# Altium project Smartfin Main PCBA.PrjPcb (part 1 of 2)
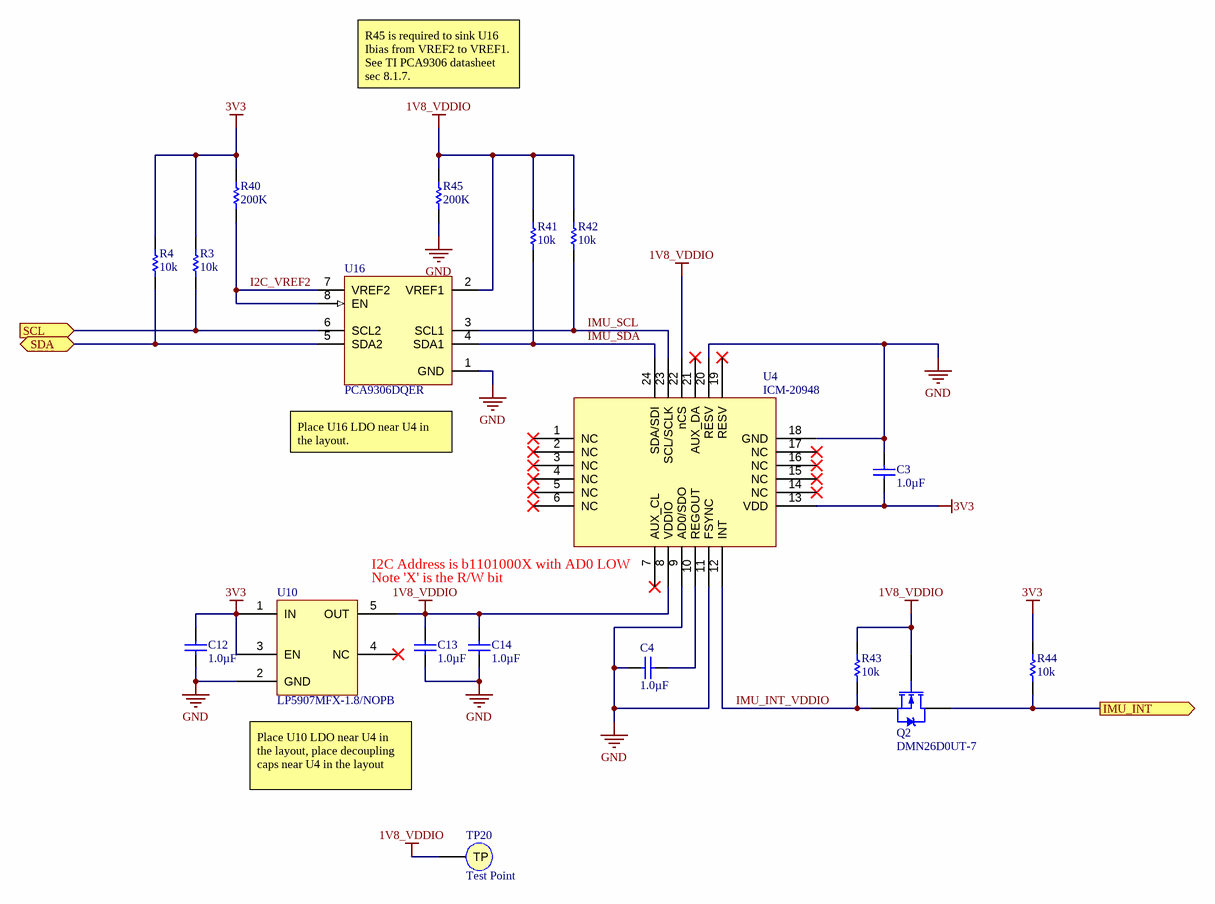
[diagram p0: Smartfin Main PCBA Motion.SchDoc]
ASY_Accept_RB_Value: 1; ASY_BOM_FILE_NAME: 644-001-031 BOM REV C ECO13237.XLSX; ASY_CLASS: 2; ASY_Confirmal_Coat_CB_Value: 0; ASY_CURRENT_REV: C; ASY_ECO_DATE1: 10/24/2019; ASY_ECO_DATE2: 2/10/2020; ASY_ECO_DATE3: 8/17/2020; ASY_ECO_DESC1: INITIAL RELEASE; ASY_ECO_DESC2: MISCELLANEOUS UPDATES. SEE ECO FOR DETAILS.; ASY_ECO_DESC3: UPDATED ASSY NOTES. UPDATED SS IN PCB. UPDATED BOM. SEE ECO FOR DETAILS.; ASY_ECO_NUM1: 12932; ASY_ECO_NUM2: 13065; ASY_ECO_NUM3: 13237; ASY_ECO_NUM_CURRENT: 13237; ASY_ECO_REV1: A; ASY_ECO_REV2: B; ASY_ECO_REV3: C; ASY_Moisture_Sensitive_CB_Value: 1; ASY_NAME: Smartfin Main PCBA; ASY_ROHS: ROHS COMPLIANT LEAD-FREE SOLDER PROCESS REQUIRED; ASY_RoHS_CB_Value: True; ASY_WASH: NOT PERMITTED; ASY_Wash_CB_Value: 0; ASY_XYRS_FILE_NAME: 644-001-032 ASY REV C XYRS ECO13237.TXT; ASYDWG_DOCNUM: 644-001-032; ASYDWG_MOISTURE_SENSITIVE: THIS DESIGN DOES NOT INCLUDE MOISTURE SENSITIVE PARTS; ASYNOTE_1: 1.  DIMENSIONS ARE IN INCHES.; ASYNOTE_2: 2.  REFER TO "644-001-031 BOM REV C ECO13237.XLSX" IN THIS ARCHIVE; ASYNOTE_4: 4.  REFER TO "644-001-032 ASY REV C XYRS ECO13237.TXT" IN THIS ARCHIVE; ASYNOTE_5: 5.  LEAD-FREE SOLDER PROCESS REQUIRED (ROHS).; ASYNOTE_7: 7.  AQUEOUS WASH IS NOT PERMITTED.; ASYNOTE_8: 8.  THIS DESIGN DOES INCLUDE MOISTURE SENSITIVE PARTS.; ASYNOTE_9: 9.  DO NOT APPLY CONFORMAL COATING.; ASYNOTE_10: 10. FINAL ASSEMBLY SHALL CONFORM TO IPC-A-610 CLASS 2.; ASYNOTE_11: 11. LABEL EACH ASSEMBLY WITH STANDARD IN HOUSE BUILD ID AND BOARD NUMBER.; ASYNOTE_MOISTURESENSITIVE: FALSE; ASYNOTE_ROHS: TRUE; ASYNOTE_WASH: FALSE; BASELINE_CURRENT_REV: C; BASELINE_DOCNUM: 644-001-033; BASELINE_ECO_DATE1: 10/24/2019; BASELINE_ECO_DATE2: 2/10/2020; BASELINE_ECO_DATE3: 8/17/2020; BASELINE_ECO_NUM1: 12932; BASELINE_ECO_NUM2: 13065; BASELINE_ECO_NUM3: 13237; BASELINE_ECO_NUM_CURRENT: 13237; BASELINE_ECO_REV1: A; BASELINE_ECO_REV2: B; BASELINE_ECO_REV3: C; BOM_DOCNUM: 644-001-031; CONTACT_EMAIL: ADOMINO@SYNCRONESS.COM; CONTACT_NAME: AMY DOMINO; CONTACT_PHONE: 720-409-5253; FAB_ACCEPT_RG_VALUE: 1; FAB_CURRENT_REV: C; FAB_DIMENSIONS: INCHES; FAB_DIMENSIONS_RG_VALUE: 0; FAB_DRILL_TOLERANCE: 0.003"; FAB_ECO_DATE1: 10/24/2019; FAB_ECO_DATE2: 2/10/2020; FAB_ECO_DATE3: 8/17/2020; FAB_ECO_DESC1: INITIAL RELEASE; FAB_ECO_DESC2: MISCELLANEOUS UPDATES. SEE ECO FOR DETAILS.; FAB_ECO_DESC3: UPDATED SS IN GPS AREA. MODIFED INTERNAL GND POURS IN GPS AREA. SEE ECO FOR DETAILS.; FAB_ECO_NUM1: 12932; FAB_ECO_NUM2: 13065; FAB_ECO_NUM3: 13237; FAB_ECO_NUM_CURRENT: 13237; FAB_ECO_REV1: A; FAB_ECO_REV2: B; FAB_ECO_REV3: C; FAB_FAB_CLASS: 2; FAB_FINISH_RG_VALUE: 0; FAB_FINISHED_CU_WEIGHT: 1.5; FAB_HOLE_LOCATION: 0.008"; FAB_INSPECT_CLASS: 2; FAB_IPC_STD: IPC-6012; FAB_LAYER_REGISTRATION: 0.005"; FAB_LAYERS: 4; FAB_MATERIAL: FR370-HR; FAB_MATERIAL_RG_VALUE: 3; FAB_MIN_ANNULAR_RING: 0.005"; FAB_OVERLAY_COLOR: WHITE; FAB_ROHS: SHALL BE ROHS COMPLIANT; FAB_SOLDER_SLIVERS: 0.004"; FAB_SOLDERMASK_COLOR: BLUE; FAB_STACKUP: USE FABRICATOR'S STANDARD LAYER STACK; FAB_STACKUP_CB_VALUE: 0; FAB_STANDARD_RG_VALUE: 1; FAB_SURFACE_FINISH: ENIG; FAB_THICKNESS: 0.032; FAB_THIEVING_SPACE: 0.100"; FABDWG_DOCNUM: 644-001-024; FABNOTE_1: 1.  DIMENSIONS ARE IN INCHES.; FABNOTE_2A: 2.  FABRICATE PCB PER IPC-6011 AND IPC-6012A, CLASS 2.; FABNOTE_2B: INSPECT PER IPC-A-600, CLASS 2.; FABNOTE_5: 5.  PCB MATERIAL IS EPOXY FIBERGLASS FR370-HR.; FABNOTE_6: 6.  PCB IS 4 LAYERS, THICKNESS IS 0.032", USE FABRICATOR'S STANDARD LAYER STACK.; FABNOTE_9: 9.  SOLDER MASK BOTH SIDES PER IPC-SM-840, COLOR IS BLUE.; FABNOTE_10: 10. OVERLAY ON BOTH SIDES, COLOR IS WHITE, UL-94V0 MARK REQUIRED.; FABNOTE_11: 11. SURFACE FINISH ON ALL EXPOSED COPPER SHALL BE ENIG.; FABNOTE_12: 12. FINISHED PCB SHALL BE ROHS COMPLIANT.; FABNOTE_CUSTOMSTACK: FALSE; FABNOTE_LAYERS: 4; FABNOTE_THICKNESS: 0.032; OVERLAY_COLOR: WHITE; OVERLAY_USE_LPI: FALSE; PROJECT_NAME: Smartfin; PROJECT_NUM: 644-001; SCH_CURRENT_REV: C; SCH_DOCNUM: 644-001-023; SOLDERMASK_COLOR: BLUE; SOLDERMASK_USE_LPI: FALSE
5 sheets, 126 parts. Net scope: flat (ports and power ports of the same name join across sheets).
Board file: Smartfin Main PCBA.PcbDoc
Sheets:
  Smartfin Main PCBA Motion.SchDoc
  Smartfin Main PCBA GPS.SchDoc
  Smartfin Main PCBA Control.SchDoc
  Smartfin Main PCBA USB.SchDoc
  Smartfin Main PCBA Wet Dry Sensor.SchDoc

## Sheet Smartfin Main PCBA Motion.SchDoc: Motion
size Tabloid; TOCFontName: Consolas; TOCFontSize: 24; TOCFontColor: 0; TOCFontAttributes: 0; TOCMaxLinesInTable: 25; TOCVerticalOffset: 200; TOCHorizontalOffset: 500; TOCHorizontalSeparation: 800; TOCVerticalSeparation: 30; TOCHorizTableSize: 640; Engineer: Amy Domino; DocumentNumber: 644-001-023; Revision: A; SheetNumber: 4; SheetTotal: 9; PageSetup: Record=PageOptions|CenterHorizontal=True|CenterVertical=True|PrintScale=0.96|XCorrection=1.00|YCorrection=1.00|PrintKind=0|BorderSize=5000000|LeftOffset=0|BottomOffset=0|Orientation=2|PaperLength=1000|PaperWidth=1000|Scale=100|PaperSource=7|PrintQuality=-4|MediaType=1|DitherType=10|PaperKind=11" x 17"|PrintScaleMode=1

### Parts
C3  1.0µF  [CAPC0402(1005)60_N]
C4  1.0µF  [CAPC0402(1005)60_N]
C12  1.0µF  [CAPC0402(1005)60_N]
C13  1.0µF  [CAPC0402(1005)60_N]
C14  1.0µF  [CAPC0402(1005)60_N]
Q2  DMN26D0UT-7  [DMN26D0UT-7-Footprint-1]
R3  10k  [RESC0402(1005)_N]
R4  10k  [RESC0402(1005)_N]
R40  200K  [RESC0402(1005)_N]
R41  10k  [RESC0402(1005)_N]
R42  10k  [RESC0402(1005)_N]
R43  10k  [RESC0402(1005)_N]
R44  10k  [RESC0402(1005)_N]
R45  200K  [RESC0402(1005)_N]
TP20  Test Point  [TESTPAD_ICT]  (no BOM)
U4  ICM-20948  [ICM-20948-Footprint-1]
U10  LP5907MFX-1.8/NOPB  [SOT95P280X145-5N]
U16  PCA9306DQER  [QFN35P100X140X40-8L]

### Ports
IMU_INT (out), SCL (in), SDA (bidir)

### Nets
1V8_VDDIO: C13.2 C14.2 Q2.G R41.2 R42.2 R43.2 R45.2 TP20.1(TP) U4.8(VDDIO) U4.22(nCS) U10.5(OUT) U16.2(VREF1)
3V3: C3.1 C12.2 R3.2 R4.2 R40.2 R44.2 U4.13(VDD) U10.1(IN) U10.3(EN)
GND: C3.2 C4.1 C12.1 C13.1 C14.1 R45.1 U4.9(AD0/SDO) U4.11(FSYNC) U4.18(GND) U4.20(RESV) U10.2(GND) U16.1(GND)
I2C_VREF2: R40.1 U16.7(VREF2) U16.8(EN)
IMU_INT: Q2.D R44.1 ; port IMU_INT
IMU_INT_VDDIO: Q2.S R43.1 U4.12(INT)
IMU_SCL: R42.1 U4.23(SCL/SCLK) U16.3(SCL1)
IMU_SDA: R41.1 U4.24(SDA/SDI) U16.4(SDA1)
SCL: R3.1 U16.6(SCL2) ; port SCL
SDA: R4.1 U16.5(SDA2) ; port SDA
NetC4_2: C4.2 U4.10(REGOUT)

Not connected (* = marked no-connect by the designer): U4 1(NC)* 2(NC)* 3(NC)* 4(NC)* 5(NC)* 6(NC)* 7(AUX_CL)* 14(NC)* 15(NC)* 16(NC)* 17(NC)* 19(RESV)* 21(AUX_DA)*; U10 4(NC)*

### Notes on the sheet
- R45 is required to sink U16 Ibias from VREF2 to VREF1. See TI PCA9306 datasheet sec 8.1.7.
- (near U16) Place U16 LDO near U4 in the layout.
- (near U4) I2C Address is b1101000X with AD0 LOW
- Note 'X' is the R/W bit
- (near U10) Place U10 LDO near U4 in the layout, place decoupling caps near U4 in the layout
- TITLE
- DOC NUMBER
- VARIANT
- REV
- 10875 dover st, suite 500
  westminster, co, 80021, usa
  syncroness.com
- FILE
- ENGINEER
- SHEET
- DATE
- OF
- THIS DOCUMENT IS CONFIDENTIAL AND THE PROPERTY OF SYNCRONESS, INC. AND ITS SUBSIDARIES. IT SHALL NOT BE REPRODUCED IN ANY MANNER NOR USED FOR ANY PURPOSE WHATSOEVER EXCEPT AS SPECIFIED IN WRITING BY SYNCRONESS, INC.

### Library data of the parts
C3 C4 C12-C14 = CMP-13694-A.6: CAP CER 1UF 10V 10% X5R 0402; Manufacturer: Yageo; Manufacturer Part Number: CC0402KRX5R6BB105; Manufacturer 2: Samsung Electro-Mechanics; Manufacturer 3: AVX Corporation; Manufacturer Part Number 2: CL05A105KP5NNNC; Manufacturer Part Number 3: 0402ZD105KAT2A; Operating Temperature: -55°C ~ 85°C; Supplier Part Number 1: 311-1439-1-ND; Supplier Part Number 2: 1276-1076-1-ND; Supplier Part Number 3: 478-4596-1-ND; Temperature Coefficient: X5R; Tolerance: ±10%; Capacitance: 1.0µF; Voltage - Rated: 10V; Supplier 2: Digi-Key; Supplier 3: Digi-Key; Supplier 1: Digi-Key; Datasheet: http://www.samsungsem.com/kr/support/product-search/mlcc/__icsFiles/afieldfile/2019/05/10/19-CL05A105KP5NNNC.pdf
Q2 = CMP-23815-A.1: MOSFET N-CH 20V 230MA SOT523; Manufacturer: Diodes Incorporated; Input Capacitance: 14.1pF; Max Power Dissipation: 300mW; Number of Elements: 1; Rds On Max: 3R; Rise Time: 7.9ns; Fall Time: 15.2ns; Turn-Off Delay Time: 13.4ns; Turn-On Delay Time: 3.8ns; Threshold Voltage: 1V; Element Configuration: Single; Gate to Source Voltage (Vgs): 10V; Mount: Surface Mount; Case/Package: SOT-523; Number of Pins: 3; Weight: 7.1E-05oz; Min Operating Temperature: -55°C; Max Operating Temperature: 150°C; Package Quantity: 1; Drain to Source Voltage (Vdss): 20V; Continuous Drain Current (ID): 230mA; Drain to Source Breakdown Voltage: 20V; Drain to Source Resistance: 3R; Power Dissipation: 300mW; Number of Channels: 1; On-State Resistance: 3R; Length: 1.7mm; Height: 0.8mm; Width: 0.85mm; Radiation Hardening: No; REACH SVHC: No SVHC; Lead Free: Lead Free; Manufacturer Part Number: DMN26D0UT-7; Supplier: Digi-Key; Supplier Part Number: DMN26D0UT-7DICT-ND
R3 R4 R41-R44 = CMP-15831-A.1: RES SMD 10K OHM 0.1% 1/16W 0402; Manufacturer: Panasonic Electronic Components; Manufacturer Part Number: ERA-2ARB103X; Power (Watts): 0.063W, 1/16W; Temperature Coefficient: ±10ppm/°C; Packaging: Cut Tape (CT); Part Status: Active; Resistance (Ohms): 10k; Tolerance: ±0.1%; Composition: Thin Film; Features: Automotive AEC-Q200; Operating Temperature: -55°C ~ 155°C; Package / Case: 0402 (1005 Metric); Supplier Device Package: 0402; Size / Dimension: 0.039" L x 0.020" W (1.00mm x 0.50mm); Height - Seated (Max): 0.016" (0.40mm); Failure Rate: -; Supplier: Digi-Key; Supplier Part Number: P10KCPCT-ND; ComponentLink1Description: Datasheet; ComponentLink1URL: https://industrial.panasonic.com/cdbs/www-data/pdf/RDM0000/AOA0000C237.pdf
R40 R45 = CMP-10579-A.1: RES 200K OHM 1/16W 5% 0402 SMD; Manufacturer: Yageo; Manufacturer Part Number: RC0402JR-07200KL; Temperature Coefficient: ±100ppm/°C; Resistance: 200K; Supplier Part Number 1: 311-200KJRCT-ND; Tolerance: 5%; Wattage: 1/16 W; Composition: Thick Film; Supplier 1: Digikey; Supplier 4: Digikey; Supplier 2: Digikey; Supplier 3: Digikey; Supplier 5: Digikey
TP20 = CMP-08242-A.3: ICT Test Point
U4 = CMP-23688-A.7: IMU ACCEL/GYRO/COMPI2C/SPI 24QFN; Manufacturer: TDK InvenSense; Sensor Type: Accelerometer,Gyroscope,Magnetometer; Output Type: SPI,I2C; Mount: Surface Mount; Case/Package: QFN; Min Operating Temperature: -40°C; Max Operating Temperature: 85°C; Packaging: Tape and Reel; Manufacturer Part Number: ICM-20948; Supplier: Digi-Key; Supplier Part Number: 1428-1123-1-ND
U10 = CMP-23434-A.4: IC REG LDO 1.8V 0.25A SOT23-5; Manufacturer: Texas Instruments; Min Input Voltage: 2.2V; Dropout Voltage: 250mV; Max Input Voltage: 5.5V; Output Current: 250mA; Polarity: Positive; Quiescent Current: 25uA; Power Supply Rejection Ratio (PSRR): 82dB; Accuracy: 2%; Case/Package: SOT-23; Contact Plating: Tin; Min Operating Temperature: -40°C ~ 125°C; Output Voltage: 1.8V; Nominal Output Voltage: 1.8V; Max Output Current: 250mA; REACH SVHC: No SVHC; Datasheet: http://www.ti.com/lit/ds/symlink/lp5907.pdf; Manufacturer Part Number: LP5907MFX-1.8/NOPB; Supplier: Digi-Key; Supplier Part Number: 296-41463-1-ND
U16 = CMP-06761-4: IC V-LEVL XLATR I2C/SMBUS 8X2SON; Manufacturer: Texas Instruments; Logic Function: Translator, Bidirectional, Open Drain; Number of Bits: 2; Output Type: I²C™/SMBus™; Number of Outputs/Channel: 1; Differential - Input:Output: No/No; Propagation Delay (Max): 0.3ns; Voltage - Supply: 1.2 V ~ 3.3 V, 1.8 V ~ 5.5 V; Supplier 1: Digi-Key; Supplier Part Number 1: 296-27957-1-ND; RoHS: RoHS Compliant; Category: Integrated Circuits (ICs); Stock: 18548; Pricing: 1=0.94, 10=0.829, 25=0.7488, 100=0.6552, 250=0.5746, 500=0.5096, 1000=0.403, 2500=0.3744 (USD); Packaging: Cut Tape (CT); Input Type: I2C/SMBus; Data Rate: -; Number of Channels: 2; Operating Temperature: -40°C ~ 85°C; Package / Case: 8-XFDFN; Supplier Device Package: 8-X2SON (1.4x1.0); Mounting Type: Surface Mount; ComponentLink1URL: http://www.ti.com/lit/ds/symlink/pca9306.pdf; ComponentLink1Description: Datasheet; Manufacturer Part Number: PCA9306DQER

## Sheet Smartfin Main PCBA GPS.SchDoc: GPS
size Tabloid; TOCFontName: Consolas; TOCFontSize: 24; TOCFontColor: 0; TOCFontAttributes: 0; TOCMaxLinesInTable: 25; TOCVerticalOffset: 200; TOCHorizontalOffset: 500; TOCHorizontalSeparation: 800; TOCVerticalSeparation: 30; TOCHorizTableSize: 640; Engineer: Amy Domino; DocumentNumber: 644-001-023; Revision: A; SheetNumber: 5; SheetTotal: 9; PageSetup: Record=PageOptions|CenterHorizontal=True|CenterVertical=True|PrintScale=0.96|XCorrection=1.00|YCorrection=1.00|PrintKind=0|BorderSize=5000000|LeftOffset=0|BottomOffset=0|Orientation=2|PaperLength=1000|PaperWidth=1000|Scale=100|PaperSource=7|PrintQuality=-4|MediaType=1|DitherType=10|PaperKind=11" x 17"|PrintScaleMode=1
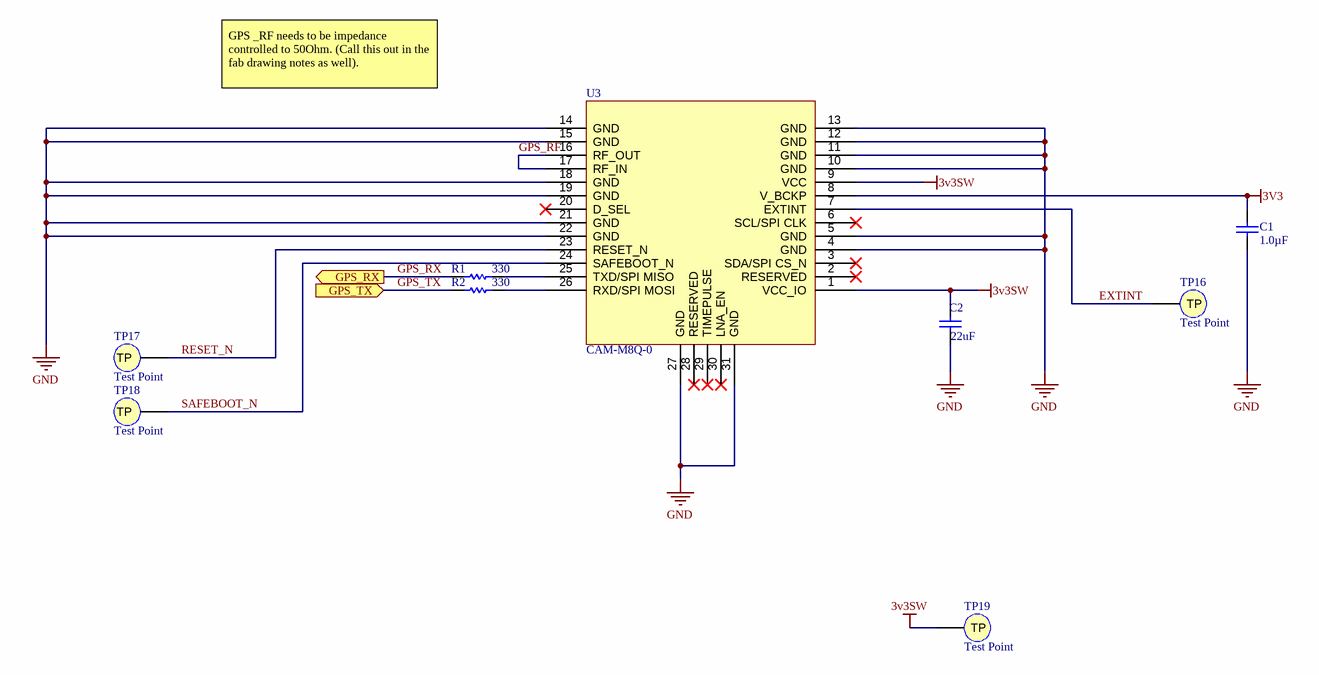
[diagram p1: Smartfin Main PCBA GPS.SchDoc]

### Parts
C1  1.0µF  [CAPC0402(1005)60_N]
C2  22uF  [CAPC0603(1608)100_N]
R1  330  [RESC1005X04N]
R2  330  [RESC1005X04N]
TP16  Test Point  [TESTPAD_ICT]  (no BOM)
TP17  Test Point  [TESTPAD_ICT]  (no BOM)
TP18  Test Point  [TESTPAD_ICT]  (no BOM)
TP19  Test Point  [TESTPAD_ICT]  (no BOM)
U3  CAM-M8Q-0  [CAM-M8Q-0-Footprint-1]

### Ports
GPS_RX (out), GPS_TX (in)

### Nets
3V3: C1.2 U3.8(V_BCKP)
3v3SW: C2.2 TP19.1(TP) U3.1(VCC_IO) U3.9(VCC)
GND: C1.1 C2.1 U3.4(GND) U3.5(GND) U3.10(GND) U3.11(GND) U3.12(GND) U3.13(GND) U3.14(GND) U3.15(GND) U3.18(GND) U3.19(GND) U3.21(GND) U3.22(GND) U3.27(GND) U3.31(GND)
EXTINT: TP16.1(TP) U3.7(EXTINT)
GPS_RF: U3.16(RF_OUT) U3.17(RF_IN)
GPS_RX: R1.1 ; port GPS_RX
GPS_TX: R2.1 ; port GPS_TX
RESET_N: TP17.1(TP) U3.23(RESET_N)
SAFEBOOT_N: TP18.1(TP) U3.24(SAFEBOOT_N)
NetR1_2: R1.2 U3.25(TXD/SPI_MISO)
NetR2_2: R2.2 U3.26(RXD/SPI_MOSI)

Not connected (* = marked no-connect by the designer): U3 2(RESERVED)* 3(SDA/SPI_CS_N)* 6(SCL/SPI_CLK)* 20(D_SEL)* 28(RESERVED)* 29(TIMEPULSE)* 30(LNA_EN)*

### Notes on the sheet
- GPS _RF needs to be impedance controlled to 50Ohm. (Call this out in the fab drawing notes as well).
- TITLE
- DOC NUMBER
- VARIANT
- REV
- 10875 dover st, suite 500
  westminster, co, 80021, usa
  syncroness.com
- FILE
- ENGINEER
- SHEET
- DATE
- OF
- THIS DOCUMENT IS CONFIDENTIAL AND THE PROPERTY OF SYNCRONESS, INC. AND ITS SUBSIDARIES. IT SHALL NOT BE REPRODUCED IN ANY MANNER NOR USED FOR ANY PURPOSE WHATSOEVER EXCEPT AS SPECIFIED IN WRITING BY SYNCRONESS, INC.

### Library data of the parts
C1 = CMP-13694-A.6: as C3 on sheet Smartfin Main PCBA Motion; Manufacturer 2: Samsung Electro-Mechanics; Manufacturer 3: AVX Corporation; Manufacturer Part Number 2: CL05A105KP5NNNC; Manufacturer Part Number 3: 0402ZD105KAT2A; Operating Temperature: -55°C ~ 85°C; Supplier Part Number 1: 311-1439-1-ND; Supplier Part Number 2: 1276-1076-1-ND; Supplier Part Number 3: 478-4596-1-ND; Temperature Coefficient: X5R; Tolerance: ±10%; Capacitance: 1.0µF; Voltage - Rated: 10V; Supplier 2: Digi-Key; Supplier 3: Digi-Key; Supplier 1: Digi-Key; Datasheet: http://www.samsungsem.com/kr/support/product-search/mlcc/__icsFiles/afieldfile/2019/05/10/19-CL05A105KP5NNNC.pdf
C2 = CMP-23693-A.2: CAP CER 22UF 10V X5R 0603; Manufacturer: Murata Electronics; Manufacturer Part Number: GRM188R61A226ME15D; Tolerance: 20%; Case/Package: 0603; Case Code (Metric): 1608; Case Code (Imperial): 0603; Capacitance: 22uF; Voltage Rating: 10V; Dielectric: X5R; Height: 1mm; Width: 0.8mm; Manufacturer 2: Samsung Electro-Mechanics; Manufacturer 3: TDK Corporation; Manufacturer Part Number 2: CL10A226MPCNUBE; Manufacturer Part Number 3: C1608X5R1A226M080AC; Operating Temperature: -55°C ~ 85°C; Supplier 1: Digi-Key; Supplier 2: Digi-Key; Supplier 3: Digi-Key; Supplier Part Number 1: 490-10476-1-ND; Supplier Part Number 2: 1276-6504-1-ND; Supplier Part Number 3: 445-9077-1-ND
R1 R2 = CMP-22585-A.1: RES SMD 330 OHM 1% 1/16W 0402; Manufacturer: Vishay Dale; Manufacturer Part Number: CRCW0402330RFKED; Power (Watts): 0.063W, 1/16W; Temperature Coefficient: ±100ppm/°C; Resistance: 330 Ohms; ComponentLink1Description: Datasheet; ComponentLink1URL: http://www.vishay.com/docs/20035/dcrcwe3.pdf; Composition: Thick Film; Features: AEC-Q200; Height - Seated (Max): 0.016" (0.40mm); Operating Temperature: -55°C ~ 155°C; Package / Case: 0402 (1005 Metric); Size / Dimension: 0.039" L x 0.020" W (1.00mm x 0.50mm); Supplier: Digi-Key; Supplier Part Number: 541-330LCT-ND; Tolerance: ±1%
TP16-TP19 = CMP-08242-A.3: ICT Test Point
U3 = CMP-23691-A.8: RF RCVR GNSS/GPS 1.575GHZ MODULE; Manufacturer: U-Blox; Interface: SPI,UART; Sensitivity: -167dBm; Current - Receiving: 29mA; Case/Package: SMD/SMT; Min Operating Temperature: -40°C; Max Operating Temperature: 85°C; Packaging: Tape and Reel; Frequency: 1.575GHz; Manufacturer Part Number: CAM-M8Q-0; Supplier: Digi-Key; Supplier Part Number: 672-CAM-M8Q-0-10CT-ND

## Sheet Smartfin Main PCBA Control.SchDoc: Control
size Tabloid; TOCFontName: Consolas; TOCFontSize: 24; TOCFontColor: 0; TOCFontAttributes: 0; TOCMaxLinesInTable: 25; TOCVerticalOffset: 200; TOCHorizontalOffset: 500; TOCHorizontalSeparation: 800; TOCVerticalSeparation: 30; TOCHorizTableSize: 640; Engineer: Amy Domino; DocumentNumber: 644-001-023; Revision: A; SheetNumber: 6; SheetTotal: 9; PageSetup: Record=PageOptions|CenterHorizontal=True|CenterVertical=True|PrintScale=0.96|XCorrection=1.00|YCorrection=1.00|PrintKind=0|BorderSize=5000000|LeftOffset=0|BottomOffset=0|Orientation=2|PaperLength=1000|PaperWidth=1000|Scale=100|PaperSource=7|PrintQuality=-4|MediaType=1|DitherType=10|PaperKind=11" x 17"|PrintScaleMode=1
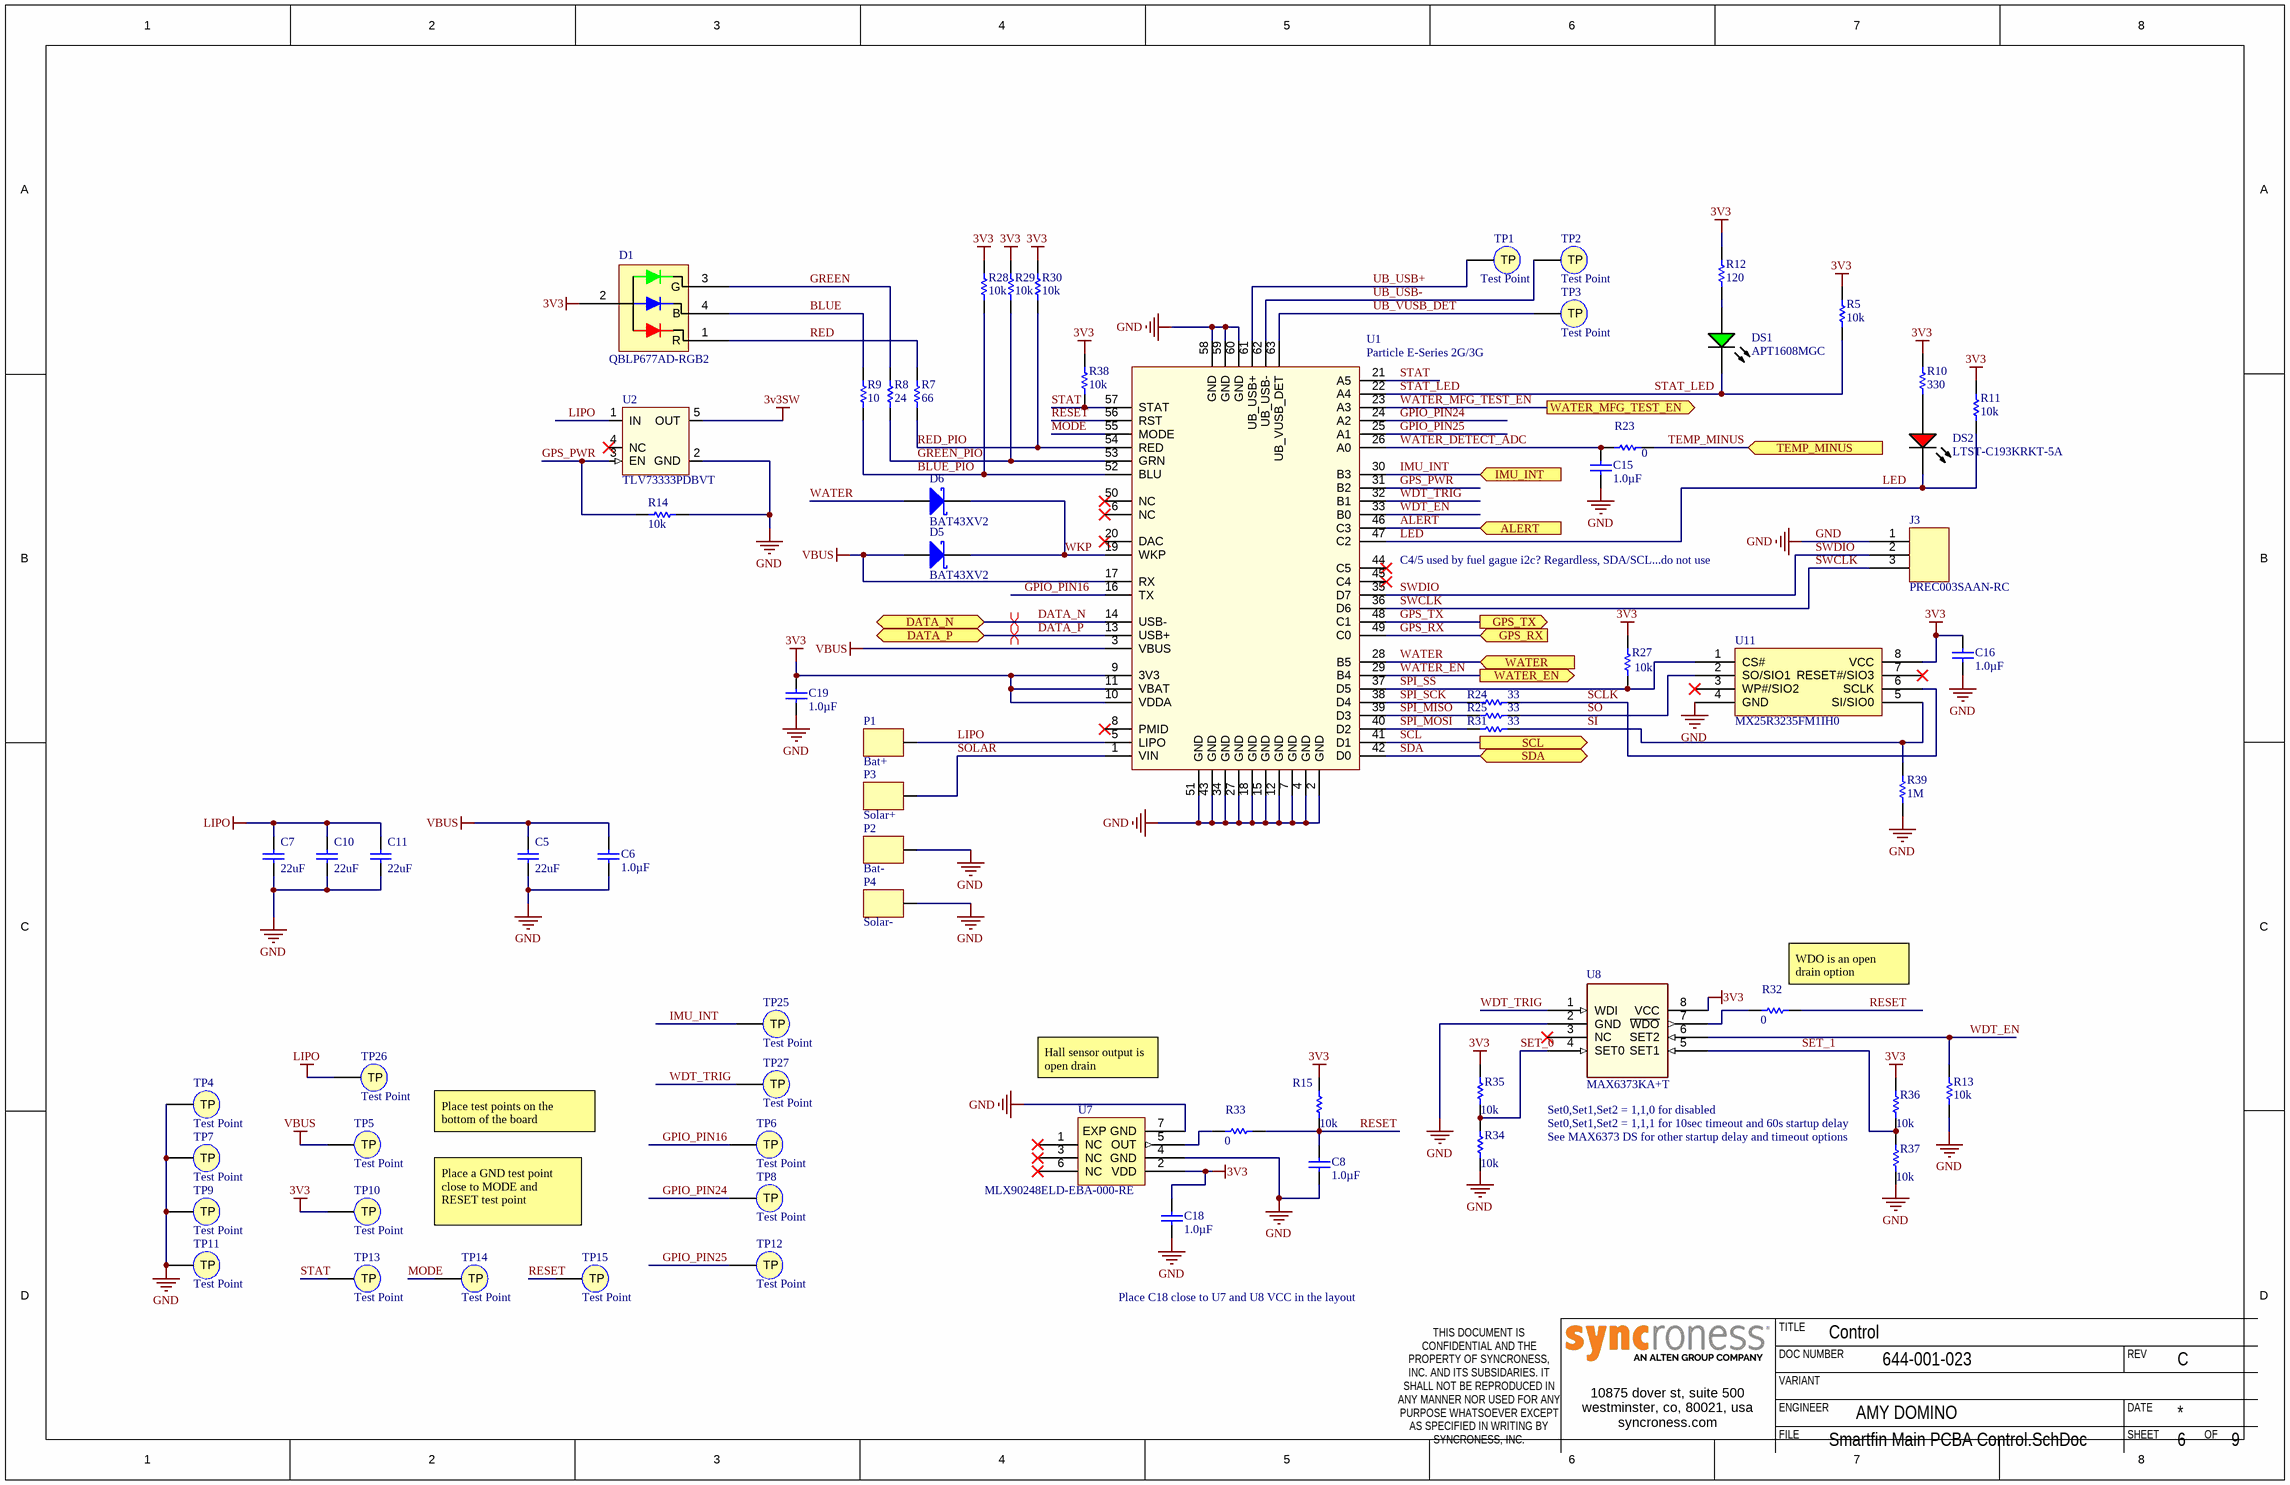
[diagram p2: Smartfin Main PCBA Control.SchDoc]

### Parts
C5  22uF  [CAPC0603(1608)100_N]
C6  1.0µF  [CAPC0402(1005)60_N]
C7  22uF  [CAPC0603(1608)100_N]
C8  1.0µF  [CAPC0402(1005)60_N]
C10  22uF  [CAPC0603(1608)100_N]
C11  22uF  [CAPC0603(1608)100_N]
C15  1.0µF  [CAPC0402(1005)60_N]
C16  1.0µF  [CAPC0402(1005)60_N]
C18  1.0µF  [CAPC0402(1005)60_N]
C19  1.0µF  [CAPC0402(1005)60_N]
D1  QBLP677AD-RGB2  [QBLP677AD-RGB2-Footprint-1]
D5  BAT43XV2  [SOD-523F]
D6  BAT43XV2  [SOD-523F]
DS1  APT1608MGC  [LED1608X08N]
DS2  LTST-C193KRKT-5A  [LTST-C193KRKT-5A_V]
J3  PREC003SAAN-RC  [HDR_Single_100mil_3D_3]
P1  Bat+  [Battery Pad-Footprint-1]  (no BOM)
P2  Bat-  [Battery Pad-Footprint-1]  (no BOM)
P3  Solar+  [Battery Pad-Footprint-1]  (no BOM)
P4  Solar-  [Battery Pad-Footprint-1]  (no BOM)
R5  10k  [RESC0402(1005)_N]
R7  66  [RESC1005X40X25LL05T10]
R8  24  [RESC1005X40X25ML10T10]
R9  10  [RESC1005X40X25ML05T10]
R10  330  [RESC1005X04N]
R11  10k  [RESC0402(1005)_N]
R12  120  [RESC1005X04N]
R13  10k  [RESC0402(1005)_N]
R14  10k  [RESC0402(1005)_N]
R15  10k  [RESC0402(1005)_N]
R23  0  [RESC0402(1005)_N]
R24  33  [RESC1005X04N]
R25  33  [RESC1005X04N]
R27  10k  [RESC0402(1005)_N]
R28  10k  [RESC0402(1005)_N]
R29  10k  [RESC0402(1005)_N]
R30  10k  [RESC0402(1005)_N]
R31  33  [RESC1005X04N]
R32  0  [RESC0402(1005)_N]
R33  0  [RESC0402(1005)_N]
R34  10k  [RESC0402(1005)_N]
R35  10k  [RESC0402(1005)_N]
R36  10k  [RESC0402(1005)_N]
R37  10k  [RESC0402(1005)_N]
R38  10k  [RESC0402(1005)_N]
R39  1M  [RESC0402(1005)_N]
TP1  Test Point  [TESTPAD_ICT]  (no BOM)
TP2  Test Point  [TESTPAD_ICT]  (no BOM)
TP3  Test Point  [TESTPAD_ICT]  (no BOM)
TP4  Test Point  [TESTPAD_ICT]  (no BOM)
TP5  Test Point  [TESTPAD_ICT]  (no BOM)
TP6  Test Point  [TESTPAD_ICT]  (no BOM)
TP7  Test Point  [TESTPAD_ICT]  (no BOM)
TP8  Test Point  [TESTPAD_ICT]  (no BOM)
TP9  Test Point  [TESTPAD_ICT]  (no BOM)
TP10  Test Point  [TESTPAD_ICT]  (no BOM)
TP11  Test Point  [TESTPAD_ICT]  (no BOM)
TP12  Test Point  [TESTPAD_ICT]  (no BOM)
TP13  Test Point  [TESTPAD_ICT]  (no BOM)
TP14  Test Point  [TESTPAD_ICT]  (no BOM)
TP15  Test Point  [TESTPAD_ICT]  (no BOM)
TP25  Test Point  [TESTPAD_ICT]  (no BOM)
TP26  Test Point  [TESTPAD_ICT]  (no BOM)
TP27  Test Point  [TESTPAD_ICT]  (no BOM)
U1  Particle E-Series 2G/3G  [Particle E-Series-Footprint-1]
U2  TLV73333PDBVT  [TLV73333PDBVR-Footprint-1]
U7  MLX90248ELD-EBA-000-RE  [MLX90248ELD-EBA-000-RE-Footprint-1]
U8  MAX6373KA+T  [MAX6373KA+T-Footprint-1]
U11  MX25R3235FM1IH0  [SOP127P600X175-8N]

### Ports
ALERT (in), DATA_N (bidir), DATA_P (bidir), GPS_RX (in), GPS_TX (out), IMU_INT (in), SCL (out), SDA (bidir), TEMP_MINUS (in), WATER (in), WATER_EN (out), WATER_MFG_TEST_EN (out)

### Nets
3V3: C16.2 C18.2 C19.2 D1.2(A) R5.2 R10.2 R11.2 R12.2 R15.2 R27.2 R28.2 R29.2 R30.2 R35.2 R36.2 R38.2 TP10.1(TP) U1.9(3V3) U1.10(VDDA) U1.11(VBAT) U7.2(VDD) U8.8(VCC) U11.8(VCC)
3v3SW: U2.5(OUT)
GND: C5.1 C6.1 C7.1 C8.1 C10.1 C11.1 C15.1 C16.1 C18.1 C19.1 J3.1 P2.1 P4.1 R13.1 R14.1 R34.1 R37.1 R39.1 TP4.1(TP) TP7.1(TP) TP9.1(TP) TP11.1(TP) U1.2(GND) U1.4(GND) U1.7(GND) U1.12(GND) U1.15(GND) U1.18(GND) U1.27(GND) U1.34(GND) U1.43(GND) U1.51(GND) U1.58(GND) U1.59(GND) U1.60(GND) U2.2(GND) U7.4(GND) U7.7(EXP_GND) U8.2(GND) U11.4(GND)
LIPO: C7.2 C10.2 C11.2 P1.1 TP26.1(TP) U1.5(LIPO) U2.1(IN)
VBUS: C5.2 C6.2 D5.A TP5.1(TP) U1.3(VBUS) U1.17(RX)
ALERT: U1.46(C3) ; port ALERT
BLUE: D1.4(B) R9.2
BLUE_PIO: R9.1 R28.1 U1.52(BLU)
DATA_N: U1.14(USB-) ; port DATA_N
DATA_P: U1.13(USB+) ; port DATA_P
GPIO_PIN16: TP6.1(TP) U1.16(TX)
GPIO_PIN24: TP8.1(TP) U1.24(A2)
GPIO_PIN25: TP12.1(TP) U1.25(A1)
GPS_PWR: R14.2 U1.31(B2) U2.3(EN)
GPS_RX: U1.49(C0) ; port GPS_RX
GPS_TX: U1.48(C1) ; port GPS_TX
GREEN: D1.3(G) R8.2
GREEN_PIO: R8.1 R29.1 U1.53(GRN)
IMU_INT: TP25.1(TP) U1.30(B3) ; port IMU_INT
LED: DS2.2(K) R11.1 U1.47(C2)
MODE: TP14.1(TP) U1.55(MODE)
RED: D1.1(R) R7.2
RED_PIO: R7.1 R30.1 U1.54(RED)
RESET: C8.2 R15.1 R32.2 R33.2 TP15.1(TP) U1.56(RST)
SCL: U1.41(D1) ; port SCL
SCLK: R24.2 U11.6(SCLK)
SDA: U1.42(D0) ; port SDA
SET_0: R34.2 R35.1 U8.4(SET0)
SET_1: R36.1 R37.2 U8.5(SET1)
SI: R31.2 R39.2 U11.5(SI/SIO0)
SO: R25.2 U11.2(SO/SIO1)
SOLAR: P3.1 U1.1(VIN)
SPI_MISO: R25.1 U1.39(D3)
SPI_MOSI: R31.1 U1.40(D2)
SPI_SCK: R24.1 U1.38(D4)
SPI_SS: R27.1 U1.37(D5) U11.1(CS#)
STAT: R38.1 TP13.1(TP) U1.21(A5) U1.57(STAT)
STAT_LED: DS1.K R5.1 U1.22(A4)
SWCLK: J3.3 U1.36(D6)
SWDIO: J3.2 U1.35(D7)
TEMP_MINUS: R23.2 ; port TEMP_MINUS
UB_USB+: TP1.1(TP) U1.61(UB_USB+)
UB_USB-: TP2.1(TP) U1.62(UB_USB-)
UB_VUSB_DET: TP3.1(TP) U1.63(UB_VUSB_DET)
WATER: D6.A U1.28(B5) ; port WATER
WATER_DETECT_ADC: C15.2 R23.1 U1.26(A0)
WATER_EN: U1.29(B4) ; port WATER_EN
WATER_MFG_TEST_EN: U1.23(A3) ; port WATER_MFG_TEST_EN
WDT_EN: R13.2 U1.33(B0) U8.6(SET2)
WDT_TRIG: TP27.1(TP) U1.32(B1) U8.1(WDI)
WKP: D5.K D6.K U1.19(WKP)
NetDS1_A: DS1.A R12.1
NetDS2_1: DS2.1(A) R10.1
NetR32_1: R32.1 U8.7(~{WDO})
NetR33_1: R33.1 U7.5(OUT)

Not connected (* = marked no-connect by the designer): U1 6(NC)* 8(PMID)* 20(DAC)* 44(C5)* 45(C4)* 50(NC)*; U2 4(NC)*; U7 1(NC)* 3(NC)* 6(NC)*; U8 3(NC)*; U11 3(WP#/SIO2)* 7(RESET#/SIO3)*

### Layout directives
differential pair: DATA_N, DATA_P

### Notes on the sheet
- (near U1) C4/5 used by fuel gague i2c? Regardless, SDA/SCL...do not use
- (near R32) WDO is an open drain option
- Hall sensor output is open drain
- Place test points on the bottom of the board
- Set0,Set1,Set2 = 1,1,0 for disabled
- (near R37) See MAX6373 DS for other startup delay and timeout options
- (near R36) Set0,Set1,Set2 = 1,1,1 for 10sec timeout and 60s startup delay
- Place a GND test point close to MODE and RESET test point
- Place C18 close to U7 and U8 VCC in the layout
- TITLE
- DOC NUMBER
- VARIANT
- REV
- 10875 dover st, suite 500
  westminster, co, 80021, usa
  syncroness.com
- FILE
- ENGINEER
- SHEET
- DATE
- OF
- THIS DOCUMENT IS CONFIDENTIAL AND THE PROPERTY OF SYNCRONESS, INC. AND ITS SUBSIDARIES. IT SHALL NOT BE REPRODUCED IN ANY MANNER NOR USED FOR ANY PURPOSE WHATSOEVER EXCEPT AS SPECIFIED IN WRITING BY SYNCRONESS, INC.

### Library data of the parts
C5 C7 C10 C11 = CMP-23693-A.2: as C2 on sheet Smartfin Main PCBA GPS; Case/Package: 0603; Case Code (Metric): 1608; Case Code (Imperial): 0603; Capacitance: 22uF; Voltage Rating: 10V; Dielectric: X5R; Height: 1mm; Width: 0.8mm; Manufacturer 2: Samsung Electro-Mechanics; Manufacturer 3: TDK Corporation; Manufacturer Part Number 2: CL10A226MPCNUBE; Manufacturer Part Number 3: C1608X5R1A226M080AC; Operating Temperature: -55°C ~ 85°C; Supplier 1: Digi-Key; Supplier 2: Digi-Key; Supplier 3: Digi-Key; Supplier Part Number 1: 490-10476-1-ND; Supplier Part Number 2: 1276-6504-1-ND; Supplier Part Number 3: 445-9077-1-ND
C6 C8 C15 C16 C18 C19 = CMP-13694-A.6: as C3 on sheet Smartfin Main PCBA Motion; Manufacturer 2: Samsung Electro-Mechanics; Manufacturer 3: AVX Corporation; Manufacturer Part Number 2: CL05A105KP5NNNC; Manufacturer Part Number 3: 0402ZD105KAT2A; Operating Temperature: -55°C ~ 85°C; Supplier Part Number 1: 311-1439-1-ND; Supplier Part Number 2: 1276-1076-1-ND; Supplier Part Number 3: 478-4596-1-ND; Temperature Coefficient: X5R; Tolerance: ±10%; Capacitance: 1.0µF; Voltage - Rated: 10V; Supplier 2: Digi-Key; Supplier 3: Digi-Key; Supplier 1: Digi-Key; Datasheet: http://www.samsungsem.com/kr/support/product-search/mlcc/__icsFiles/afieldfile/2019/05/10/19-CL05A105KP5NNNC.pdf
D1 = CMP-23886-A.1: LED RGB, 3528 PLCC4 DOME LENS, 2; Manufacturer: QT Brightek (QTB); Color: Blue,Green,Red; Lens Style: Round,Dome; Element Configuration: Common Anode; Lens Transparency: Diffused; Test Current: 20mA; Viewing Angle: 30°; Lens Size: 2.40mm; Mount: Surface Mount; Case/Package: SMD/SMT; Length: 3.20mm; Height: 3.30mm; Width: 2.7mm; Manufacturer Part Number: QBLP677AD-RGB2; Supplier: Digi-Key; Supplier Part Number: 1516-QBLP677AD-RGB2CT-ND
D5 D6 = CMP-23830-A.2: DIODE SCHOTTKY 30V 200MA SOD523F; Manufacturer: ON Semiconductor; Max Surge Current: 4A; Max Power Dissipation: 200mW; Recovery Time: 5ns; Forward Voltage: 1V; Max Reverse Leakage Current: 500nA; Peak Reverse Current: 10mA; Element Configuration: Single; Manufacturer Part Number: BAT43XV2; Packaging: Tape and Reel; Mount: Surface Mount; Number of Pins: 2; Weight: 0.01g; Contact Plating: Tin,Matte; Min Operating Temperature: -65°C; Max Operating Temperature: 125°C; Package Quantity: 1; Forward Current: 200mA; Average Rectified Current: 200mA; Reverse Recovery Time: 5ns; Max Repetitive Reverse Voltage (Vrrm): 30V; Peak Non-Repetitive Surge Current: 4A; Max Forward Surge Current (Ifsm): 200mA; Max Reverse Voltage (DC): 30V; Length: 1.3mm; Height: 0.7mm; Width: 0.9mm; Radiation Hardening: No; Supplier: Digi-Key; Supplier Part Number: BAT43XV2CT-ND
DS1 = CMP-08086-A.3: LED 1.6X0.8MM 570NM GRN CLR SMD; Manufacturer: Kingbright; Color: Green; Current - Test: 20mA; Lens Style/Size: Rectangle with Flat Top, 1.2mm x 0.8mm; Lens Type: Clear; Millicandela Rating: 70mcd; Viewing Angle: 120°; Voltage - Forward (Vf) (Typ): 2.1V; Wavelength - Peak: 574nm; Manufacturer Part Number: APT1608MGC; ComponentLink1URL: http://www.kingbrightusa.com/images/catalog/SPEC/APT1608MGC.pdf; Height: 0.75mm; Mounting Type: Surface Mount; Package / Case: 0603 (1608 Metric); Packaging: Cut Tape (CT); Pricing: 0.62; RoHS: RoHS Compliant; Size / Dimension: 1.60mm L x 0.80mm W; Stock: 19251; Supplier Part Number 1: 754-1118-1-ND; Wavelength - Dominant: 570nm; Category: Optoelectronics; ComponentLink1Description: Datasheet; Luminous Flux @ Current - Test: -; Supplier 1: Digi-Key
DS2 = CMP-23696-A.2: LED RED CLEAR CHIP SMD 0603; Manufacturer: Lite-On Inc.; Viewing Angle: 130°; Lens Style: Diffused,Colorless,Clear,Rectangular; Luminous Intensity: 45mcd; Forward Current: 5mA; Forward Voltage: 2.3V; Dominant Wavelength: 631nm; Power Dissipation: 50mW; Reverse Voltage: 5V; Case/Package: 0603; Color: Red; Test Current: 5mA; Height: 0.45mm; Datasheet: http://optoelectronics.liteon.com/upload/download/DS22-2005-077/LTST-C193KRKT-5A.PDF; Manufacturer Part Number: LTST-C193KRKT-5A; Operating Temperature: -55°C ~ 85°C; Supplier: Digi-Key; Supplier Part Number: 160-1830-1-ND
J3 = CMP-09249-5: CONN HEADER .100" SNGL STR 3POS; Manufacturer: Sullins Connector Solutions; Connector Type: Header, Unshrouded; Number of Positions: 3; Number of Positions Loaded: All; Pitch: 0.100" (2.54mm); SchLibComponentName: PREC003SAAN-RC; Manufacturer Part Number: PREC003SAAN-RC; RoHS: RoHS Compliant; Category: Connectors, Interconnects; Packaging: Bulk; Contact Type: Male Pin; Number of Rows: 1; Contact Mating Length: 0.230" (5.84mm); Mounting Type: Through Hole; Termination: Solder; Fastening Type: -; Features: -; Contact Finish: Tin; Contact Finish Thickness: -; Color: Black; ComponentLink1URL: http://media.digikey.com/PDF/Data%20Sheets/Sullins%20PDFs/z%20RzCzzzSzzN-RC,%20ST,11635-B.pdf; ComponentLink1Description: http://media.digikey.com/PDF/Data%20Sheets/Sullins%20PDFs/z%20RzCzzzSzzN-RC,%20ST,11635-B.pdf; Supplier Part Number: S1012EC-03-ND; Supplier: Digi-Key
P1-P4 = CMP-23776-A.3: Battery Pad for Smartfin Main board
R5 R11 R13-R15 R27-R30 R34-R38 = CMP-15831-A.1: as R3 on sheet Smartfin Main PCBA Motion; Packaging: Cut Tape (CT); Part Status: Active; Resistance (Ohms): 10k; Tolerance: ±0.1%; Composition: Thin Film; Features: Automotive AEC-Q200; Operating Temperature: -55°C ~ 155°C; Package / Case: 0402 (1005 Metric); Supplier Device Package: 0402; Size / Dimension: 0.039" L x 0.020" W (1.00mm x 0.50mm); Height - Seated (Max): 0.016" (0.40mm); Failure Rate: -; Supplier: Digi-Key; Supplier Part Number: P10KCPCT-ND; ComponentLink1Description: Datasheet; ComponentLink1URL: https://industrial.panasonic.com/cdbs/www-data/pdf/RDM0000/AOA0000C237.pdf
R7 = CMP-2002-07771-1: Res Thick Film 0402 66.5 Ohm 1% 1/16W ±100ppm/°C Molded SMD Paper T/R; Part Number: RC0402FR-0766R5L; Manufacturer: Yageo; Additional Feature: LASER TRIMMABLE; Rated Power Dissipation (P): 62.5mW; Rated Temperature: 70°C; Resistance: 66.5R; Working Voltage: 50V; Package Height: 0.35mm; Package Length: 1mm; Package Width: 0.5mm; Supplier 1: Digi-Key; Supplier Part Number 1: YAG3210CT-ND; Manufacturer Part Number: RC0402FR-0766R5L; RoHS: Yes; Category: Chip SMD Resistors; Stock 1: 25875; Pricing 1: 1=0.10000, 10=0.01600, 100=0.00660, 1000=0.00299, 2500=0.00259, 5000=0.00214 (USD); Mount: Surface Mount; Number of Pins: 2; Package Shape: Rectangular; Size Code: 0402; Terminal Finish: Nickel; Min Operating Temperature: -55°C; Max Operating Temperature: 155°C; Tolerance: 1%; JESD-609 Code: e3; Resistor Type: FIXED RESISTOR; Construction: Chip; Package Style: SMTMeter; Packaging: Tape and Reel; Technology: METAL GLAZE/THICK FILM; Temperature Coefficient: 100ppm/°C; Termination: Wraparound; REACH SVHC: Yes; RoHS Compliant: Yes; ComponentLink1URL: https://datasheet.ciiva.com:443/pdfs/VipMasterIC/IC/YAGO/YAGO-S-A0008145938/YAGO-S-A0008145938-1.pdf?src-supplier=IHS+Markit; ComponentLink1Description: https://datasheet.ciiva.com:443/pdfs/VipMasterIC/IC/YAGO/YAGO-S-A0008145938/YAGO-S-A0008145938-1.pdf?src-supplier=IHS+Markit; ComponentLink2URL: https://datasheet.ciiva.com/8888/pyu-rc0402-51-rohs-l-6-8888441.pdf?src-supplier=Avnet; ComponentLink2Description: https://datasheet.ciiva.com/8888/pyu-rc0402-51-rohs-l-6-8888441.pdf?src-supplier=Avnet; ComponentLink3URL: https://datasheet.ciiva.com/28397/pyu-rc0402-51-rohs-l-6-28397577.pdf?src-supplier=Avnet+Europe; ComponentLink3Description: https://datasheet.ciiva.com/28397/pyu-rc0402-51-rohs-l-6-28397577.pdf?src-supplier=Avnet+Europe; ComponentLink4URL: https://datasheet.ciiva.com/16867/pyu-rc0402-51-rohs-l-6-16867534.pdf?src-supplier=Avnet+Europe; ComponentLink4Description: https://datasheet.ciiva.com/16867/pyu-rc0402-51-rohs-l-6-16867534.pdf?src-supplier=Avnet+Europe
R8 = CMP-2002-05717-1: Fixed Resistor, Metal Glaze/thick Film, 0.063W, 24ohm, 50V, 1% +/-Tol, 100ppm/Cel, Surface Mount, 0402; Manufacturer: TE Connectivity / AMP; Part Number: CRG0402F24R; Rated Power Dissipation (P): 63mW; Rated Temperature: 70°C; Resistance: 24R; Temperature Coefficient: 100ppm/°C; Additional Feature: LASER TRIMMABLE; Package Height: 0.35mm; Package Length: 1mm; Package Width: 0.5mm; Supplier 1: Newark; Supplier Part Number 1: 42AJ6992; Manufacturer Part Number: CRG0402F24R; RoHS: Yes; Category: Chip SMD Resistors; Stock 1: 80000; Pricing 1: 10000=0.00300 (USD); Mount: Surface Mount; Number of Pins: 2; Package Shape: Rectangular; Size Code: 0402; Min Operating Temperature: -55°C; Max Operating Temperature: 125°C; Tolerance: 1%; Resistor Type: FIXED RESISTOR; Packaging: Tape and Reel; Technology: METAL GLAZE/THICK FILM; Termination: Wraparound; Working Voltage: 50V; Construction: Rectangular; Package Style: SMTMeter; REACH SVHC: Yes; RoHS Compliant: Yes; ComponentLink1URL: https://www.te.com:443/usa-en/product-8-1622826-0.datasheet.pdf?src-supplier=IHS+Markit; ComponentLink1Description: https://www.te.com:443/usa-en/product-8-1622826-0.datasheet.pdf?src-supplier=IHS+Markit; ComponentLink2URL: https://datasheet.ciiva.com/22706/1610603-22706087.pdf?src-supplier=Element14; ComponentLink2Description: https://datasheet.ciiva.com/22706/1610603-22706087.pdf?src-supplier=Element14; ComponentLink3URL: https://datasheet.ciiva.com/12574/eng-ds-1773204-g-12574725.pdf?src-supplier=Mouser; ComponentLink3Description: https://datasheet.ciiva.com/12574/eng-ds-1773204-g-12574725.pdf?src-supplier=Mouser
R9 = CMP-2002-07358-1: Fixed Resistor, Metal Glaze/thick Film, 0.0625W, 10ohm, 50V, 1% +/-Tol, 200ppm/Cel, Surface Mount, 0402; Manufacturer: Yageo / Phycomp; Part Number: RC0402FR-0710RL; Additional Feature: LASER TRIMMABLE; Rated Power Dissipation (P): 62.5mW; Rated Temperature: 70°C; Resistance: 10R; Temperature Coefficient: 200ppm/°C; Package Height: 0.35mm; Package Length: 1mm; Package Width: 0.5mm; Supplier 1: Digi-Key; Supplier Part Number 1: 311-10.0LRCT-ND; Manufacturer Part Number: RC0402FR-0710RL; RoHS: Yes; Category: Chip SMD Resistors; Stock 1: 2132757; Pricing 1: 1=0.10000, 10=0.02500, 100=0.01000, 1000=0.00451, 2500=0.00392, 5000=0.00323 (USD); Mount: Surface Mount; Number of Pins: 2; Package Shape: Rectangular; Size Code: 0402; Terminal Finish: Nickel; Min Operating Temperature: -55°C; Max Operating Temperature: 155°C; Tolerance: 1%; JESD-609 Code: e3; Resistor Type: FIXED RESISTOR; Construction: Chip; Package Style: SMTMeter; Packaging: Tape and Reel; Technology: METAL GLAZE/THICK FILM; Termination: Wraparound; Working Voltage: 50V; REACH SVHC: Yes; RoHS Compliant: Yes; ComponentLink1URL: https://datasheet.ciiva.com:443/pdfs/VipMasterIC/IC/YAGO/YAGO-S-A0008145938/YAGO-S-A0008145938-1.pdf?src-supplier=IHS+Markit; ComponentLink1Description: https://datasheet.ciiva.com:443/pdfs/VipMasterIC/IC/YAGO/YAGO-S-A0008145938/YAGO-S-A0008145938-1.pdf?src-supplier=IHS+Markit; ComponentLink2URL: https://datasheet.ciiva.com/11808/0900766b80c66297-11808764.pdf?src-supplier=RSComponents; ComponentLink2Description: https://datasheet.ciiva.com/11808/0900766b80c66297-11808764.pdf?src-supplier=RSComponents; ComponentLink3URL: https://datasheet.ciiva.com/46394/1018594-46394954.pdf?src-supplier=Element14; ComponentLink3Description: https://datasheet.ciiva.com/46394/1018594-46394954.pdf?src-supplier=Element14; ComponentLink4URL: https://datasheet.ciiva.com/7849/1018594-7849818.pdf?src-supplier=Element14; ComponentLink4Description: https://datasheet.ciiva.com/7849/1018594-7849818.pdf?src-supplier=Element14; ComponentLink5URL: https://datasheet.ciiva.com/7849/1018594-7849819.pdf?src-supplier=Element14; ComponentLink5Description: https://datasheet.ciiva.com/7849/1018594-7849819.pdf?src-supplier=Element14; ComponentLink6URL: https://datasheet.ciiva.com/15189/getdatasheetpartid-323697-15189339.pdf?src-supplier=Verical; ComponentLink6Description: https://datasheet.ciiva.com/15189/getdatasheetpartid-323697-15189339.pdf?src-supplier=Verical
R10 = CMP-22585-A.1: as R1 on sheet Smartfin Main PCBA GPS; ComponentLink1Description: Datasheet; ComponentLink1URL: http://www.vishay.com/docs/20035/dcrcwe3.pdf; Composition: Thick Film; Features: AEC-Q200; Height - Seated (Max): 0.016" (0.40mm); Operating Temperature: -55°C ~ 155°C; Package / Case: 0402 (1005 Metric); Size / Dimension: 0.039" L x 0.020" W (1.00mm x 0.50mm); Supplier: Digi-Key; Supplier Part Number: 541-330LCT-ND; Tolerance: ±1%
R12 = CMP-20572-A.1: RES SMD 120 OHM 5% 1/16W 0402; Manufacturer: Vishay Dale; Manufacturer Part Number: CRCW0402120RJNED; Power (Watts): 0.063W, 1/16W; Resistance: 120 Ohms; Temperature Coefficient: ±200ppm/°C; ComponentLink1Description: Datasheet; ComponentLink1URL: http://www.vishay.com/docs/20035/dcrcwe3.pdf; Composition: Thick Film; Features: AEC-Q200; Height - Seated (Max): 0.016" (0.40mm); Operating Temperature: -55°C ~ 155°C; Package / Case: 0402 (1005 Metric); Packaging: Cut Tape (CT); Part Status: Active; Size / Dimension: 0.039" L x 0.020" W (1.00mm x 0.50mm); Supplier: Digi-Key; Supplier Part Number: 541-120JCT-ND; Tolerance: ±5%
R23 R32 R33 = CMP-10566-A.1: RES 0.0 OHM 1/16W 0402 SMD; Manufacturer: Vishay/Dale; Manufacturer Part Number: CRCW04020000Z0ED; Temperature Coefficient: ±100ppm/°C; Tolerance: 5%; Wattage: 1/16 W; Composition: Thick Film; Supplier 1: Digikey; Supplier 4: Digikey; Supplier 2: Digikey; Supplier 3: Digikey; Supplier 5: Digikey; Manufacturer 2: Rohm Semiconductor; Manufacturer 3: Yageo; Manufacturer 4: Stackpole Electronics Inc; Manufacturer Part Number 2: MCR01MRTJ000; Manufacturer Part Number 3: RC0402JR-070RL; Manufacturer Part Number 4: RMCF0402ZT0R00; Resistance: 0; Supplier Part Number 1: 541-0.0JCT-ND; Supplier Part Number 2: RHM0.0CECT-ND; Supplier Part Number 3: 311-0.0JRCT-ND; Supplier Part Number 4: RMCF0402ZT0R00CT-ND
R24 R25 R31 = CMP-20566-A.1: RES SMD 33 OHM 5% 1/16W 0402; Manufacturer: Vishay Dale; Manufacturer Part Number: CRCW040233R0JNED; Power (Watts): 0.063W, 1/16W; Resistance: 33 Ohms; Temperature Coefficient: ±200ppm/°C; ComponentLink1Description: Datasheet; ComponentLink1URL: http://www.vishay.com/docs/20035/dcrcwe3.pdf; Composition: Thick Film; Features: AEC-Q200; Height - Seated (Max): 0.016" (0.40mm); Operating Temperature: -55°C ~ 155°C; Package / Case: 0402 (1005 Metric); Packaging: Cut Tape (CT); Part Status: Active; Size / Dimension: 0.039" L x 0.020" W (1.00mm x 0.50mm); Supplier: Digi-Key; Supplier Part Number: 541-33JCT-ND; Tolerance: ±5%
R39 = CMP-10629-A.1: RES 1.0M OHM 1/16W 5% 0402 SMD; Manufacturer Part Number: RC0402JR-071ML; Manufacturer: Yageo; Temperature Coefficient: ±100ppm/°C; Manufacturer Part Number 2: RMCF0402JT1M00; Resistance: 1M; Supplier Part Number 1: 311-1.0MJRCT-ND; Supplier Part Number 2: RMCF0402JT1M00CT-ND; Tolerance: 5%; Wattage: 1/16 W; Composition: Thick Film; Supplier 1: Digikey; Supplier 4: Digikey; Supplier 2: Digikey; Supplier 3: Digikey; Supplier 5: Digikey; Manufacturer 2: Stackpole Electronics Inc
TP1-TP15 TP25-TP27 = CMP-08242-A.3: ICT Test Point
U1 = CMP-23710-A.5: Global 2G/3G, U-blox SARA-U201 Modem; Manufacturer Part Number: E310; Manufacturer: Particle; Supplier: Particle; Datasheet: https://docs.particle.io/datasheets/cellular/e-series-datasheet/; Supplier Part Number: E310MOD1
U2 = CMP-23694-A.8: IC REG LINEAR 3.3V 300MA SOT23-5; Manufacturer: Texas Instruments; Number of Outputs: 1; Min Input Voltage: 1.4V; Max Input Voltage: 5.5V; Dropout Voltage: 125mV; Min Current Limit: 360mA; Polarity: Positive; Quiescent Current: 60uA; Accuracy: 1%; Output Type: Fixed; Mount: Surface Mount; Case/Package: SOT-23-5; Number of Pins: 5; Weight: 0.000557oz; Contact Plating: Gold; Min Operating Temperature: -40°C; Max Operating Temperature: 125°C; Packaging: Tape and Reel; Max Output Current: 300mA; Output Voltage: 3.3V; Output Current: 300mA; Number of Regulators: 1; Package Quantity: 3000; Radiation Hardening: No; Lead Free: Lead Free; Manufacturer Part Number: TLV73333PDBVT; Supplier: Digi-Key; Supplier Part Number: 296-40673-1-ND; ComponentLink1Description: datasheet; ComponentLink1URL: vhttps://www.ti.com/lit/ds/symlink/tlv733p.pdf
U7 = CMP-23697-A.7: MAGNETIC SWITCH OMNIPOLAR 6UTQFN; Manufacturer: Melexis; Max Supply Current: 10uA; Max Output Current: 10mA; Sensing Method: Hall Effect; Number of Pins: 6; Min Operating Temperature: -40°C; Max Operating Temperature: 85°C; Packaging: Bulk; Lead Free: Lead Free; Manufacturer Part Number: MLX90248ELD-EBA-000-RE; Supplier: Digi-Key; Supplier Part Number: MLX90248ELD-EBA-000-RECT-ND
U8 = CMP-23704-A.5: IC WATCHDOG TIMER SOT23-8; Manufacturer: Maxim Integrated; Max Power Dissipation: 700mW; Operating Supply Current: 10uA; Frequency: 33kHz; Max Supply Voltage: 5.5V; Min Supply Voltage: 2.5V; Case/Package: SOT-23; Height: 1.3mm; Datasheet: https://datasheets.maximintegrated.com/en/ds/MAX6369-MAX6374.pdf; Manufacturer Part Number: MAX6373KA+T; Operating Temperature: -40°C ~ 125°C; Supplier: Digi-Key; Supplier Part Number: MAX6373KA+TCT-ND
U11 = CMP-23702-A.4: IC FLASH 32M SPI 80MHZ 8SOP; Manufacturer: Macronix; Memory Type: FLASH,NOR; Interface: SPI,Serial; Case/Package: SOIC; Min Operating Temperature: -40°C; Max Operating Temperature: 85°C; Packaging: Rail/Tube; Frequency: 80MHz; Lead Free: Lead Free; Manufacturer Part Number: MX25R3235FM1IH0; Supplier: Digi-Key; Supplier Part Number: 1092-1175-ND

## Sheet Smartfin Main PCBA USB.SchDoc: USB
size Tabloid; TOCFontName: Consolas; TOCFontSize: 24; TOCFontColor: 0; TOCFontAttributes: 0; TOCMaxLinesInTable: 25; TOCVerticalOffset: 200; TOCHorizontalOffset: 500; TOCHorizontalSeparation: 800; TOCVerticalSeparation: 30; TOCHorizTableSize: 640; Engineer: Amy Domino; DocumentNumber: 644-001-023; Revision: A; SheetNumber: 7; SheetTotal: 9; PageSetup: Record=PageOptions|CenterHorizontal=True|CenterVertical=True|PrintScale=0.96|XCorrection=1.00|YCorrection=1.00|PrintKind=0|BorderSize=5000000|LeftOffset=0|BottomOffset=0|Orientation=2|PaperLength=1000|PaperWidth=1000|Scale=100|PaperSource=7|PrintQuality=-4|MediaType=1|DitherType=10|PaperKind=11" x 17"|PrintScaleMode=1
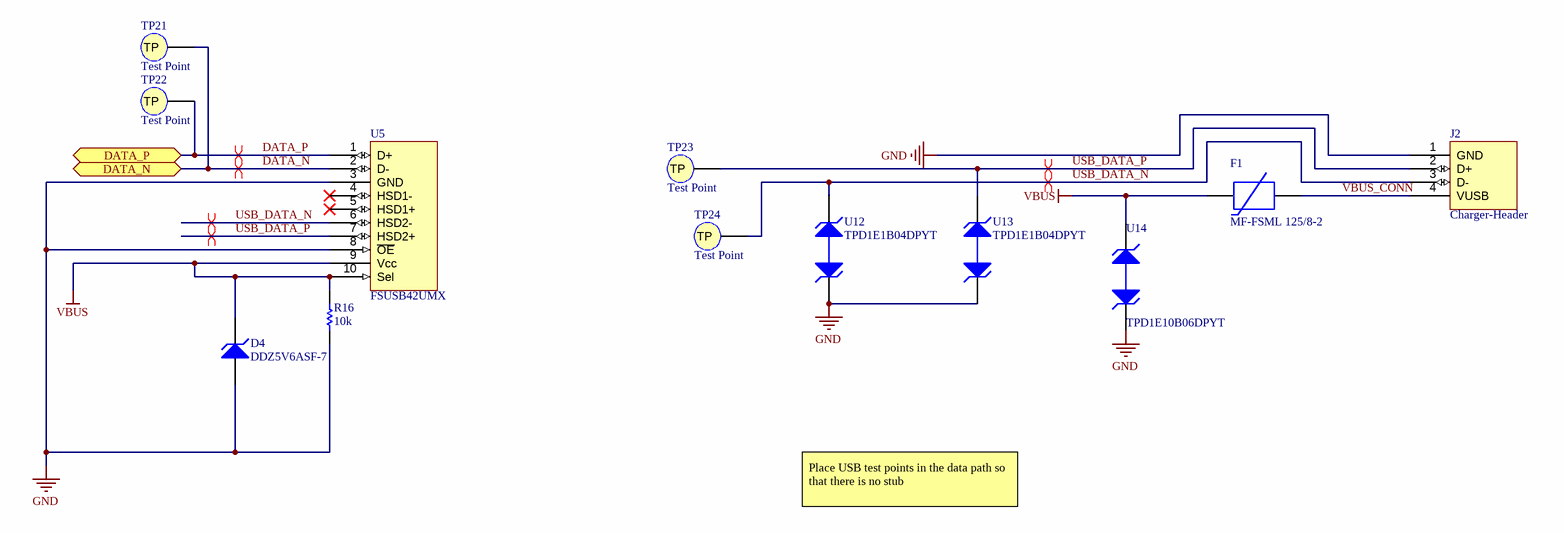
[diagram p3: Smartfin Main PCBA USB.SchDoc]

### Parts
D4  DDZ5V6ASF-7  [SOD323F]
F1  MF-FSML 125/8-2  [MF-FSMF010X-2-Footprint-1]
J2  Charger-Header  [New footprint 1]  (no BOM)
R16  10k  [RESC0402(1005)_N]
TP21  Test Point  [TESTPAD_ICT]  (no BOM)
TP22  Test Point  [TESTPAD_ICT]  (no BOM)
TP23  Test Point  [TESTPAD_ICT]  (no BOM)
TP24  Test Point  [TESTPAD_ICT]  (no BOM)
U5  FSUSB42UMX  [FSUSB42UMX-Footprint-1]
U12  TPD1E1B04DPYT  [TPD1E10B06DPYT-Footprint-1]
U13  TPD1E1B04DPYT  [TPD1E10B06DPYT-Footprint-1]
U14  TPD1E10B06DPYT  [TPD1E10B06DPYT-Footprint-1]

### Ports
DATA_N (bidir), DATA_P (bidir)

### Nets
GND: D4.A J2.1(GND) R16.1 U5.3(GND) U5.8(~{OE}) U12.1 U13.2 U14.2
VBUS: D4.K F1.2 R16.2 U5.9(Vcc) U5.10(Sel) U14.1
DATA_N: TP21.1(TP) U5.2(D-) ; port DATA_N
DATA_P: TP22.1(TP) U5.1(D+) ; port DATA_P
USB_DATA_N: J2.3(D-) TP24.1(TP) U5.6(HSD2-) U12.2
USB_DATA_P: J2.2(D+) TP23.1(TP) U5.7(HSD2+) U13.1
VBUS_CONN: F1.1 J2.4(VUSB)

Not connected (* = marked no-connect by the designer): U5 4(HSD1-)* 5(HSD1+)*

### Layout directives
differential pair: DATA_N, DATA_P, USB_DATA_N, USB_DATA_P

### Notes on the sheet
- Place USB test points in the data path so that there is no stub
- TITLE
- DOC NUMBER
- VARIANT
- REV
- 10875 dover st, suite 500
  westminster, co, 80021, usa
  syncroness.com
- FILE
- ENGINEER
- SHEET
- DATE
- OF
- THIS DOCUMENT IS CONFIDENTIAL AND THE PROPERTY OF SYNCRONESS, INC. AND ITS SUBSIDARIES. IT SHALL NOT BE REPRODUCED IN ANY MANNER NOR USED FOR ANY PURPOSE WHATSOEVER EXCEPT AS SPECIFIED IN WRITING BY SYNCRONESS, INC.

### Library data of the parts
D4 = CMP-16992-A.4: DIODE ZENER 5.42V 200MW SOD-323; Manufacturer: Diodes Inc.; Current - Reverse Leakage @ Vr: 7.5uA @ 2V; Impedance (Max) (Zzt): 80 Ohm; Voltage - Zener (Nom) (Vz): 5.42; Power - Max: 500mW; Tolerance: ±3%; Voltage - Forward (Vf) (Max) @ If: 900mV @ 10mA; Supplier Part Number 1: DDZ5V6ASF-7DICT-ND; Category: Discrete Semiconductor Products; Mounting Type: Surface Mount; Operating Temperature: -65°C ~ 150°C; Package / Case: SC-90, SOD-323F; Packaging: Cut Tape (CT); RoHS: RoHS Compliant; Supplier 1: Digi-Key; Supplier Device Package: SOD-323F; Manufacturer Part Number: DDZ5V6ASF-7
F1 = CMP-23709-A.6: 0603 SMD POLYMER PTC 1.25A/8V; Manufacturer: Bourns; Max Current Rating: 50A; Resistance: 0.02; Operating Supply Voltage: 8V; Power Dissipation: 500mW; Hold Current: 100mA; Trip Current: 2500mA; Time to Trip: 3s; Approvals: UL,TUV; Mount: Surface Mount; Case/Package: 0603; Case Code (Metric): 1608; Case Code (Imperial): 0603; Number of Terminals: 2; Terminal Material: Gold; Min Operating Temperature: -40°C; Max Operating Temperature: 85°C; Package Quantity: 5000; Packaging: Tape and Reel; Voltage Rating: 8V; Termination: SMD/SMT; Voltage Rating (DC): 8V; Length: 1.65mm; Height: 0.7mm; Width: 0.85mm; Radiation Hardening: No; REACH SVHC: No SVHC; Lead Free: Lead Free; Manufacturer Part Number: MF-FSML 125/8-2; Supplier: DIgikey; Supplier Part Number: MF-FSML125/8-2CT-ND
J2 = CMP-23701-A.5: usb power connection
R16 = CMP-15831-A.1: as R3 on sheet Smartfin Main PCBA Motion; Packaging: Cut Tape (CT); Part Status: Active; Resistance (Ohms): 10k; Tolerance: ±0.1%; Composition: Thin Film; Features: Automotive AEC-Q200; Operating Temperature: -55°C ~ 155°C; Package / Case: 0402 (1005 Metric); Supplier Device Package: 0402; Size / Dimension: 0.039" L x 0.020" W (1.00mm x 0.50mm); Height - Seated (Max): 0.016" (0.40mm); Failure Rate: -; Supplier: Digi-Key; Supplier Part Number: P10KCPCT-ND; ComponentLink1Description: Datasheet; ComponentLink1URL: https://industrial.panasonic.com/cdbs/www-data/pdf/RDM0000/AOA0000C237.pdf
TP21-TP24 = CMP-08242-A.3: ICT Test Point
U5 = CMP-23705-A.6: USB MULTIMEDIA SWITCHES; Manufacturer: On Semiconductor; Number of Inputs: 2; Number of Channels: 1; Min Supply Voltage: 3V; Max Supply Voltage: 4.3V; Data Rate: 480Mbps; Output Current: 100mA; Propagation Delay: 0.25ns; Bandwidth: 720MHz; Nominal Supply Current: 1uA; Turn-Off Delay Time: 25ns; On-State Resistance: 6.5R; Turn-On Delay Time: 30ns; Throw Configuration: DPDT; Supply Type: Single; Mount: Surface Mount; Number of Pins: 10; Weight: 18.08g; Min Operating Temperature: -40°C; Max Operating Temperature: 85°C; Number of Outputs: 2; Packaging: Tape and Reel; Operating Supply Voltage: 4.3V; Package Quantity: 1; Number of Ports: 2; Termination: SMD/SMT; Length: 1.4mm; Height: 0.5mm; Width: 1.8mm; Radiation Hardening: No; REACH SVHC: No SVHC; Lead Free: Lead Free; Manufacturer Part Number: FSUSB42UMX; Datasheet: https://www.onsemi.com/pub/Collateral/FSUSB42-D.PDF; Supplier: Digi-Key; Supplier Part Number: FSUSB42UMXCT-ND
U12 U13 = CMP-23707-A.9: TVS DIODE 3.6V 8.5V 2X1SON; Manufacturer: Texas Instruments; Capacitance: 1pF; Interface: LVDS,USB,Ethernet; Number of Channels: 1; Min Operating Temperature: -40°C; Max Operating Temperature: 125°C; Lead Free: Lead Free; Manufacturer Part Number: TPD1E1B04DPYT; Supplier: Digi-Key; Supplier Part Number: 296-47364-1-ND; ComponentLink1Description: datasheet; ComponentLink1URL: https://www.ti.com/lit/ds/symlink/tpd1e1b04.pdf
U14 = CMP-23708-A.6: TVS DIODE 5.5VWM 14VC 2X2SON; Manufacturer: Texas Instruments; Direction: Bidirectional; Number of Channels: 1; Peak Pulse Current: 5A; Breakdown Voltage: 6V; Interface: GPIO; Capacitance: 12pF; Reverse Standoff Voltage: 5.5V; Clamping Voltage: 14V; Peak Pulse Power: 90W; Power Line Protection: No; Leakage Current: 100nA; Element Configuration: Single; Case/Package: 0402; Number of Pins: 2; Min Operating Temperature: -40°C; Max Operating Temperature: 125°C; Composition: Zener; Length: 1.1mm; Radiation Hardening: No; Lead Free: Lead Free; Packaging: Tape and Reel; Package Quantity: 250; Number of Bidirectional Channels: 1; Min Breakdown Voltage: 6V; Polarity: Bidirectional; Working Voltage: 5.5V; Max Power Dissipation: 90W; Manufacturer Part Number: TPD1E10B06DPYT; Supplier: Digi-Key; Supplier Part Number: 296-41842-1-ND